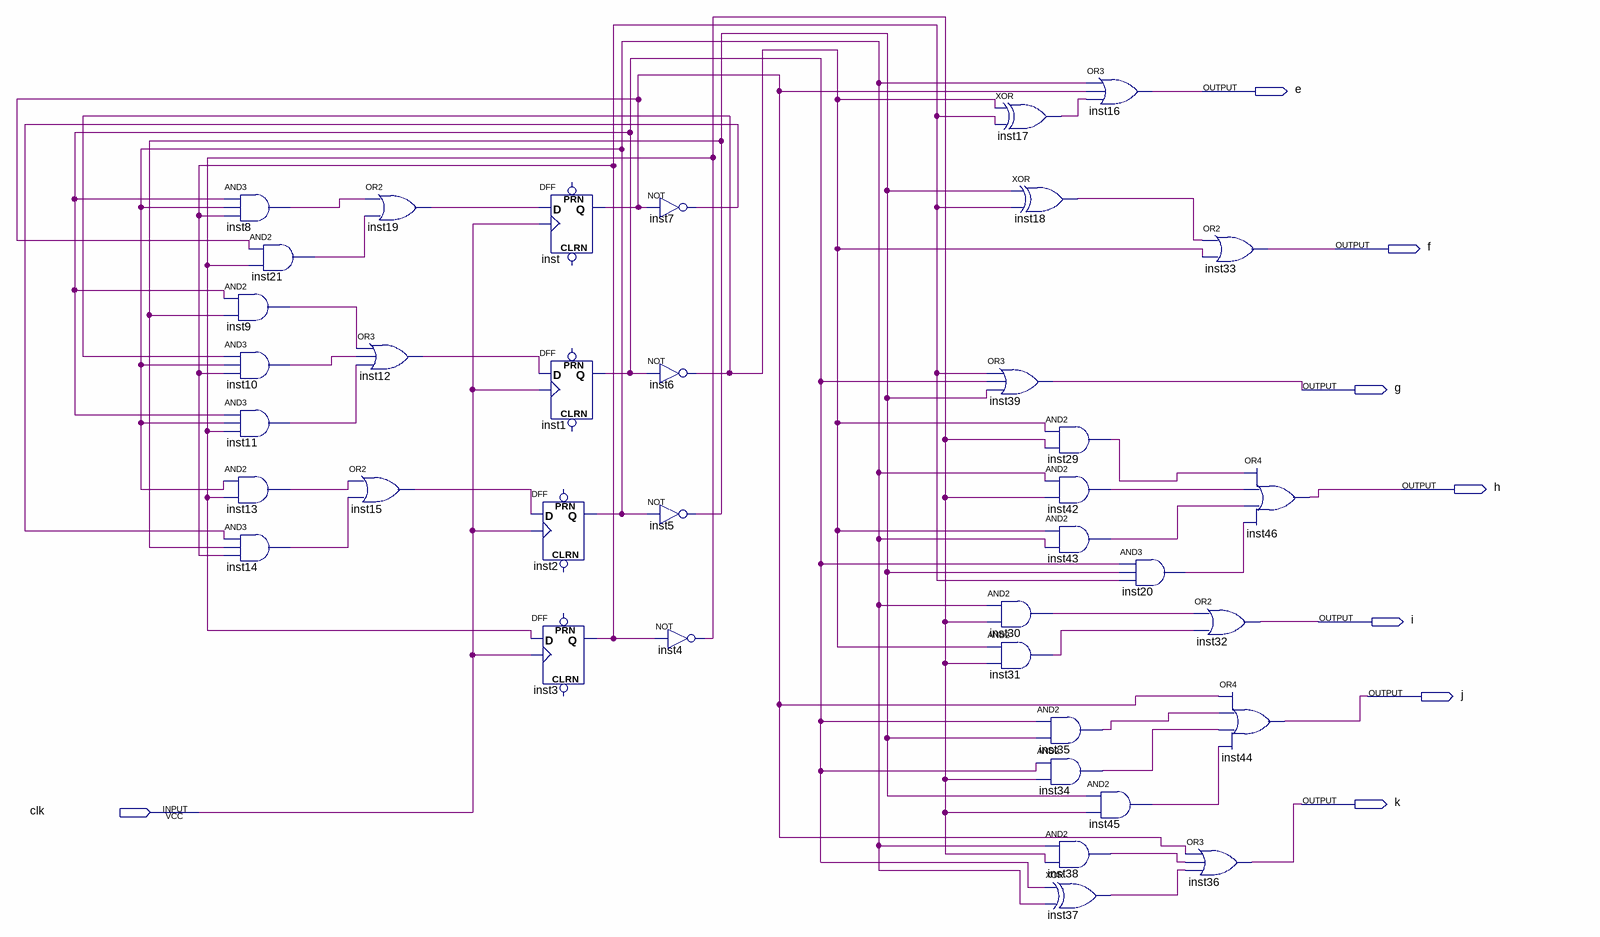
[diagram p0: schematic sheet]
// Quartus schematic FPGA3-1.bdf as structural Verilog: 38 symbols, 8 pins
module \FPGA3-1  (
  input  clk,
  output e,
  output f,
  output g,
  output h,
  output i,
  output j,
  output k
);

  wire inst1_q, inst2_q, inst3_q, inst4_out, inst5_out, inst6_out, inst7_out, inst8_out, inst9_out,
       inst10_out, inst11_out, inst12_out, inst13_out, inst14_out, inst15_out, inst17_out, inst18_out,
       inst19_out, inst20_out, inst21_out, inst29_out, inst30_out, inst31_out, inst34_out, inst35_out,
       inst37_out, inst38_out, inst42_out, inst43_out, inst45_out, inst_q;

  and inst8 (inst8_out, inst1_q, inst2_q, inst3_q);
  and inst9 (inst9_out, inst1_q, inst5_out);
  and inst10 (inst10_out, inst6_out, inst2_q, inst3_q);
  and inst11 (inst11_out, inst1_q, inst2_q, inst4_out);
  and inst13 (inst13_out, inst2_q, inst4_out);
  and inst14 (inst14_out, inst7_out, inst5_out, inst3_q);
  and inst21 (inst21_out, inst_q, inst4_out);
  or inst19 (inst19_out, inst8_out, inst21_out);
  or inst12 (inst12_out, inst9_out, inst10_out, inst11_out);
  or inst15 (inst15_out, inst13_out, inst14_out);
  DFF inst (.CLK(clk), .D(inst19_out), .Q(inst_q));  // open: CLRN, PRN
  DFF inst1 (.CLK(clk), .D(inst12_out), .Q(inst1_q));  // open: CLRN, PRN
  DFF inst2 (.CLK(clk), .D(inst15_out), .Q(inst2_q));  // open: CLRN, PRN
  DFF inst3 (.CLK(clk), .D(inst4_out), .Q(inst3_q));  // open: CLRN, PRN
  not inst7 (inst7_out, inst_q);
  not inst6 (inst6_out, inst1_q);
  not inst5 (inst5_out, inst2_q);
  not inst4 (inst4_out, inst3_q);
  xor inst17 (inst17_out, inst6_out, inst3_q);
  xor inst18 (inst18_out, inst5_out, inst3_q);
  or inst39 (g, inst3_q, inst1_q, inst5_out);
  and inst30 (inst30_out, inst2_q, inst4_out);
  and inst31 (inst31_out, inst6_out, inst4_out);
  or inst16 (e, inst2_q, inst_q, inst17_out);
  and inst29 (inst29_out, inst6_out, inst4_out);
  and inst42 (inst42_out, inst2_q, inst4_out);
  and inst43 (inst43_out, inst6_out, inst2_q);
  and inst35 (inst35_out, inst1_q, inst5_out);
  and inst34 (inst34_out, inst1_q, inst4_out);
  and inst45 (inst45_out, inst5_out, inst4_out);
  and inst38 (inst38_out, inst2_q, inst4_out);
  xor inst37 (inst37_out, inst1_q, inst2_q);
  and inst20 (inst20_out, inst1_q, inst5_out, inst3_q);
  or inst33 (f, inst18_out, inst6_out);
  or inst32 (i, inst30_out, inst31_out);
  or inst44 (j, inst_q, inst35_out, inst34_out, inst45_out);
  or inst36 (k, inst_q, inst38_out, inst37_out);
  or inst46 (h, inst29_out, inst42_out, inst43_out, inst20_out);
endmodule
